# EAGLE design 7218 (EAGLE 5.11)
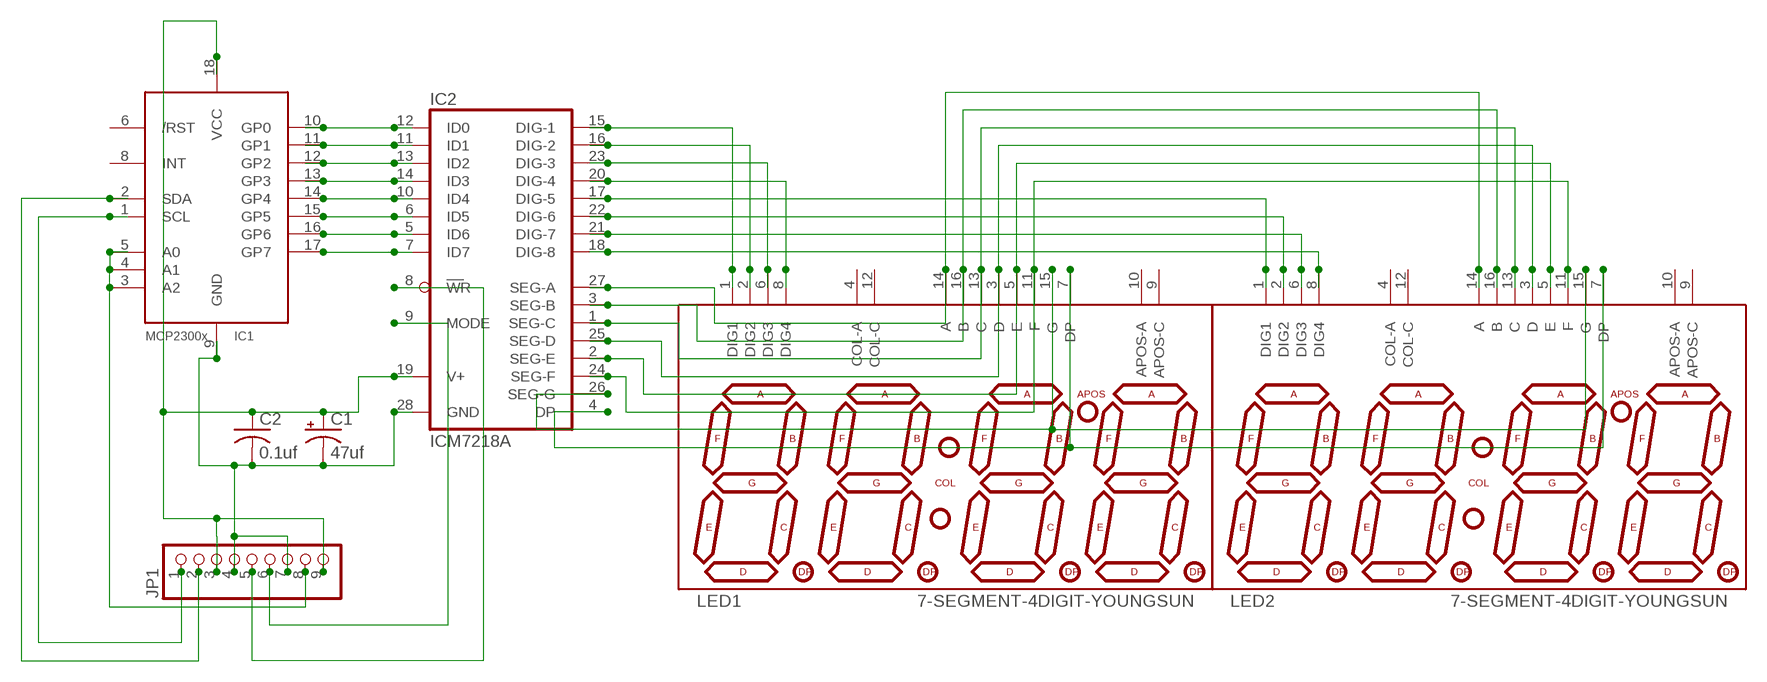
[diagram p0: schematic, sheet 1]

## Parts
C1  47uf  CAP_POLPTH2  [CPOL-RADIAL-10UF-25V]
C2  0.1uf  C-US050-030X075  [C050-030X075]
IC1  MCP2300X/P  [DIL18]
IC2  ICM7218A  [DIL28-6]
JP1  PINHD-1X9  [1X09-BIG]
LED1  7-SEGMENT-4DIGIT-YOUNGSUN  [7-SEGMENT-4DIGIT-YOUNGSUN]
LED2  7-SEGMENT-4DIGIT-YOUNGSUN  [7-SEGMENT-4DIGIT-YOUNGSUN]

## Nets
N$1: IC1.10(GP0) IC2.12(ID0)
N$2: IC1.11(GP1) IC2.11(ID1)
N$3: IC1.12(GP2) IC2.13(ID2)
N$4: IC1.13(GP3) IC2.14(ID3)
N$5: IC1.14(GP4) IC2.10(ID4)
N$6: IC1.15(GP5) IC2.6(ID5)
N$7: IC1.16(GP6) IC2.5(ID6)
N$8: IC1.17(GP7) IC2.7(ID7)
N$10: C1.2(-) C2.2 IC1.9(GND) IC2.28(GND) JP1.4 JP1.7
N$11: IC2.15(DIG-1) LED1.1(DIG1)
N$12: IC2.16(DIG-2) LED1.2(DIG2)
N$13: IC2.23(DIG-3) LED1.6(DIG3)
N$14: IC2.20(DIG-4) LED1.8(DIG4)
N$15: IC2.17(DIG-5) LED2.1(DIG1)
N$16: IC2.22(DIG-6) LED2.2(DIG2)
N$17: IC2.21(DIG-7) LED2.6(DIG3)
N$18: IC2.18(DIG-8) LED2.8(DIG4)
N$19: IC2.27(SEG-A) LED1.14(A) LED2.14(A)
N$20: IC2.3(SEG-B) LED1.16(B) LED2.16(B)
N$21: IC2.1(SEG-C) LED1.13(C) LED2.13(C)
N$22: IC2.25(SEG-D) LED1.3(D) LED2.3(D)
N$23: IC2.2(SEG-E) LED1.5(E) LED2.5(E)
N$24: IC2.24(SEG-F) LED1.11(F) LED2.11(F)
N$25: IC2.26(SEG-G) LED1.15(G) LED2.15(G)
N$26: IC2.4(DP) LED1.7(DP) LED2.7(DP)
N$30: IC1.2(SDA) JP1.2
N$31: IC1.1(SCL) JP1.1
N$32: C1.1(+) C2.1 IC1.18(VCC) IC2.19(V+) JP1.3 JP1.9
N$33: IC2.8(WR) JP1.5
N$34: IC2.9(MODE) JP1.6
N$35: IC1.3(A2) IC1.4(A1) IC1.5(A0) JP1.8
Unconnected: IC1.6(/RST) IC1.8(INT) LED1.4(COL-A) LED1.9(APOS-C) LED1.10(APOS-A) LED1.12(COL-C) LED2.4(COL-A) LED2.9(APOS-C) LED2.10(APOS-A) LED2.12(COL-C)

## Library data of the parts
C1 = SparkFun:CAP_POL: Capacitor Polarized These are standard SMD and PTH capacitors. Normally 10uF, 47uF, and 100uF in electrolytic and tantalum varieties. Always verify the external diameter of the through hole cap, it varies with capacity, voltage, and manufacturer. The EIA devices should be standard.
C2 = adafruit:C-US: CAPACITOR, American symbol
IC1 = adafruit:MCP2300X: MCP23008 Inexpensive i2c i/o expander - 8 general purpose i/o pins with optional pullups
IC2 = maxim:ICM7218A: LED DECODER DRIVER; MF: INTERSIL; MPN: ICM7218AIJI; OC_FARNELL: 405991; OC_NEWARK: 06F7544
JP1 = adafruit:PINHD-1X9: Pin header 1x10 0.1" spacing With round pins
LED1 LED2 = SparkFun:7-SEGMENT-4DIGIT-YOUNGSUN: This is a part for the 4-Digit 7-segment LEDs from Young Sun. Different from the Digikey LEDs, all 16 pins are used. The LONGPADS Variant is used for a test jig, but you may like it because there is more pad to solder to. If you are concerned about routing space, the standard works just fine though.

## Board
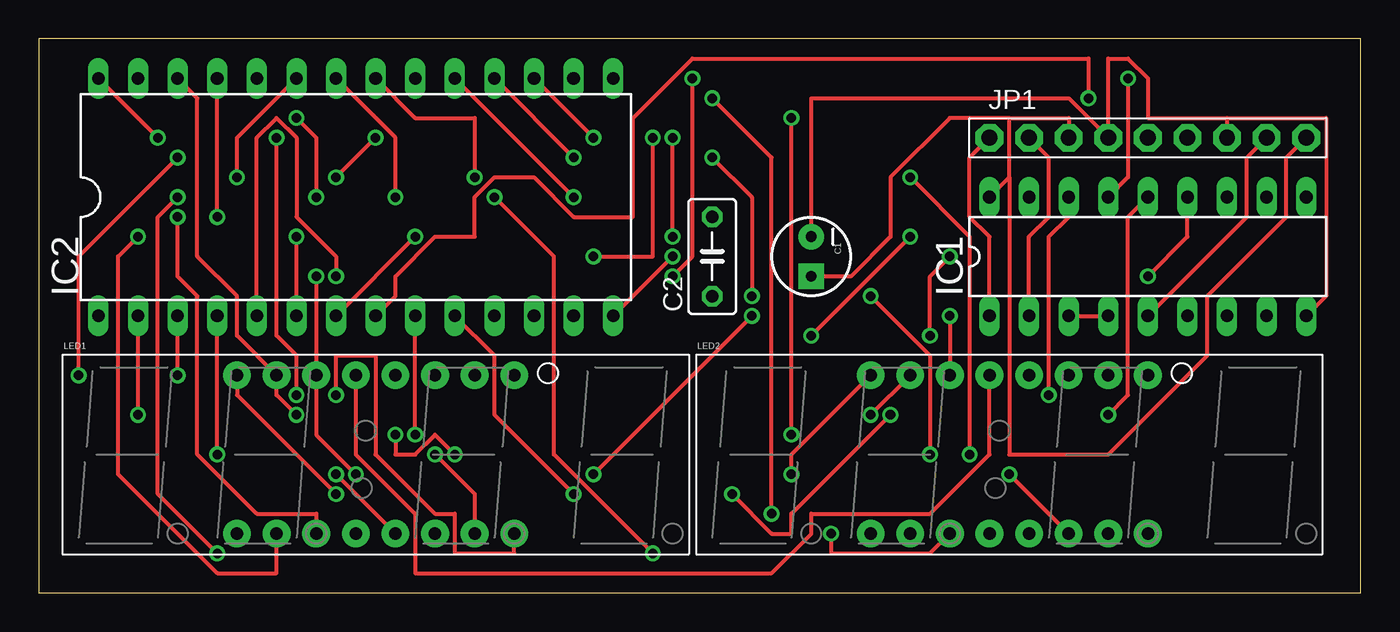
[diagram p1: board, top side]
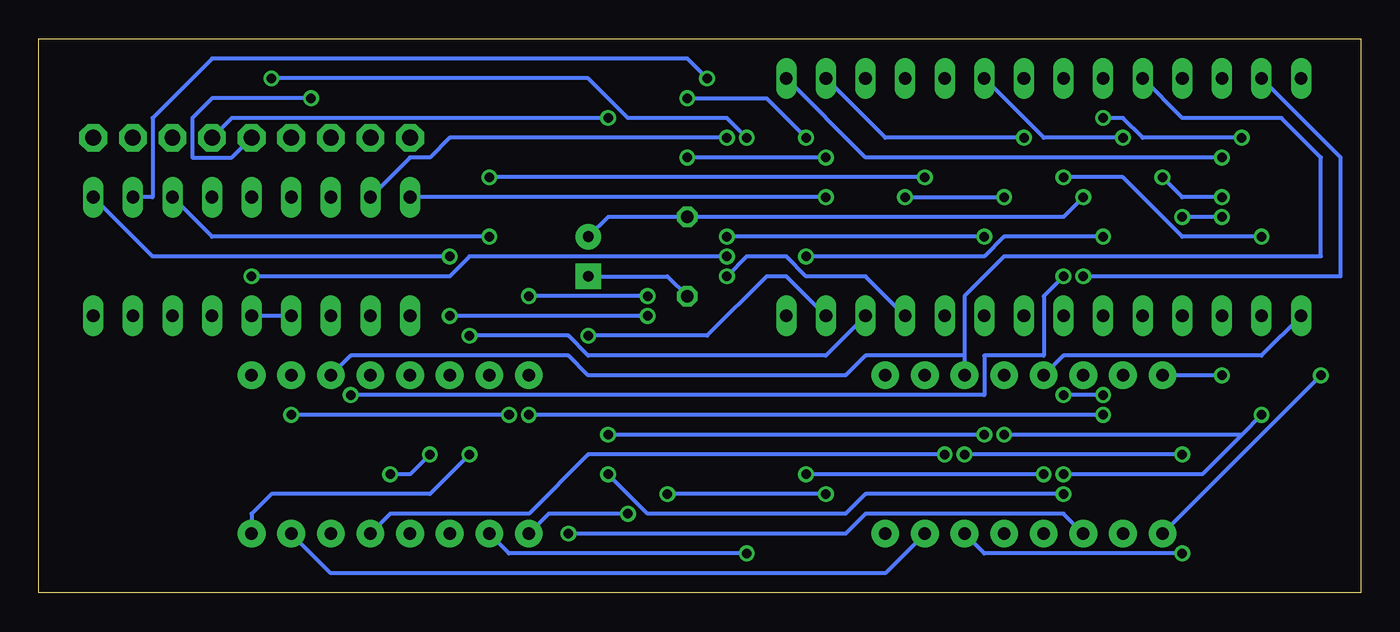
[diagram p2: board, bottom side, seen from below]

Size 84.76 x 35.55 mm. Coordinates in mm from the lower left corner, seen from the top.
Outline: 0,0 84.76,0 84.76,35.55 0,35.55 0,0
Copper layers (1*16): Top 0.035mm / dielectric 1.5mm / Bottom 0.035mm
Design rules "default": minimum track width 10mil, minimum drill 24mil, track to track 8mil, track to pad 8mil, pad to pad 8mil, via to via 8mil, smd to smd 8mil, copper to edge 40mil, drill to drill 8mil, minimum pad ring 10mil, minimum via ring 8mil, stop-mask expansion 4mil, vias tented up to drill 0mil, thermal gap 10mil

### Footprints (pad centres in the part's own frame; a part is rotated, then mirrored left to right if it is on the bottom)
CPOL-RADIAL-10UF-25V = drill 0.7 pad 1.651 square: 1 1.27,0 | drill 0.7 pad 1.651 round: 2 -1.27,0
C050-030X075 = drill 0.813 octagon: 1 -2.54,0; 2 2.54,0
DIL18 = drill 0.813 long: 1 -10.16,-3.81; 2 -7.62,-3.81; 3 -5.08,-3.81; 4 -2.54,-3.81; 5 0,-3.81; 6 2.54,-3.81; 7 5.08,-3.81; 8 7.62,-3.81; 9 10.16,-3.81; 10 10.16,3.81; 11 7.62,3.81; 12 5.08,3.81; 13 2.54,3.81; 14 0,3.81; 15 -2.54,3.81; 16 -5.08,3.81; 17 -7.62,3.81; 18 -10.16,3.81
DIL28-6 = drill 0.813 long: 1 -16.51,-7.62; 2 -13.97,-7.62; 3 -11.43,-7.62; 4 -8.89,-7.62; 5 -6.35,-7.62; 6 -3.81,-7.62; 7 -1.27,-7.62; 8 1.27,-7.62; 9 3.81,-7.62; 10 6.35,-7.62; 11 8.89,-7.62; 12 11.43,-7.62; 13 13.97,-7.62; 14 16.51,-7.62; 15 16.51,7.62; 16 13.97,7.62; 17 11.43,7.62; 18 8.89,7.62; 19 6.35,7.62; 20 3.81,7.62; 21 1.27,7.62; 22 -1.27,7.62; 23 -3.81,7.62; 24 -6.35,7.62; 25 -8.89,7.62; 26 -11.43,7.62; 27 -13.97,7.62; 28 -16.51,7.62
1X09-BIG = drill 1.016 pad 1.778 octagon: 1 -10.16,0; 2 -7.62,0; 3 -5.08,0; 4 -2.54,0; 5 0,0; 6 2.54,0; 7 5.08,0; 8 7.62,0; 9 10.16,0
7-SEGMENT-4DIGIT-YOUNGSUN = drill 0.8 pad 1.778 round: 1 -8.89,-5.08; 2 -6.35,-5.08; 3 -3.81,-5.08; 4 -1.27,-5.08; 5 1.27,-5.08; 6 3.81,-5.08; 7 6.35,-5.08; 8 8.89,-5.08; 9 8.89,5.08; 10 6.35,5.08; 11 3.81,5.08; 12 1.27,5.08; 13 -1.27,5.08; 14 -3.81,5.08; 15 -6.35,5.08; 16 -8.89,5.08

### Placement (x,y rotation side)
C1  49.53,21.59 270 top
C2  43.18,21.59 90 top
IC1  71.12,21.59 0 top
IC2  20.32,25.4 0 top
JP1  71.12,29.21 0 top
LED1  21.59,8.89 0 top
LED2  62.23,8.89 0 top

### Tracks (layer width: path | path; a pad name or v marks a point on that pad's centre or on a via)
N$1  (via drill 0.61)
  Top 0.254: v57.15,16.51 57.15,20.32 v58.42,21.59
  Bottom 0.254: IC2.12 34.29,15.24 49.53,15.24 50.8,16.51 v57.15,16.51 | v58.42,21.59 77.47,21.59 IC1.10
N$2  (via drill 0.61)
  Top 0.254: v40.64,20.32 41.91,21.59 v41.91,33.02
  Bottom 0.254: IC2.11 31.75,20.32 35.56,20.32 36.83,21.59 39.37,21.59 v40.64,20.32 | v41.91,33.02 43.18,34.29 73.66,34.29 77.47,30.48 77.47,25.4 IC1.11
N$3  (via drill 0.61)
  Top 0.254: v49.53,16.51 v55.88,22.86
  Bottom 0.254: IC2.13 36.83,20.32 38.1,20.32 41.91,16.51 v49.53,16.51 | v55.88,22.86 73.66,22.86 IC1.12
N$4  (via drill 0.61)
  Top 0.254: IC2.14 v40.64,21.59 | v71.12,20.32 73.66,22.86 IC1.13
  Bottom 0.254: v40.64,21.59 57.15,21.59 58.42,20.32 v71.12,20.32
N$5  (via drill 0.61)
  Top 0.254: IC2.10 29.21,15.24 29.21,11.43 v34.29,6.35 | v44.45,6.35 46.99,3.81 48.26,3.81 48.26,5.08 v54.61,11.43 | v68.58,11.43 69.85,12.7 69.85,24.13 IC1.14
  Bottom 0.254: v34.29,6.35 v44.45,6.35 | v54.61,11.43 v68.58,11.43
N$6  (via drill 0.61)
  Top 0.254: IC2.6 v16.51,22.86 | v35.56,21.59 39.37,21.59 v39.37,29.21 | v69.85,33.02 69.85,26.67 IC1.15
  Bottom 0.254: v16.51,22.86 22.86,22.86 24.13,21.59 v35.56,21.59 | v39.37,29.21 40.64,30.48 46.99,30.48 49.53,33.02 v69.85,33.02
N$7  (via drill 0.61)
  Top 0.254: IC2.5 13.97,29.21 15.24,30.48 16.51,29.21 16.51,24.13 19.05,21.59 v19.05,20.32 | v64.77,12.7 64.77,22.86 66.04,24.13 IC1.16
  Bottom 0.254: v19.05,20.32 20.32,19.05 20.32,15.24 24.13,15.24 24.13,12.7 v64.77,12.7
N$8  (via drill 0.61)
  Top 0.254: IC2.7 v24.13,22.86 | v40.64,22.86 v40.64,29.21
  Bottom 0.254: v24.13,22.86 v40.64,22.86 | v40.64,29.21 58.42,29.21 59.69,27.94 60.96,27.94 IC1.17
N$10  (via drill 0.61)
  Top 0.254: IC1.9 82.55,19.05 82.55,30.48 76.2,30.48 | 76.2,30.48 JP1.7 | IC2.28 v7.62,29.21 | v16.51,30.48 17.78,29.21 v17.78,25.4 | C1.2 49.53,31.75 66.04,31.75 JP1.4 68.58,34.29 69.85,34.29 71.12,33.02 71.12,30.48 76.2,30.48
  Bottom 0.254: v7.62,29.21 13.97,29.21 15.24,30.48 v16.51,30.48 | v17.78,25.4 19.05,24.13 C2.2 48.26,24.13 C1.2
N$11  (via drill 0.61)
  Top 0.254: v8.89,27.94 2.54,21.59 v2.54,13.97
  Bottom 0.254: IC2.15 31.75,27.94 v8.89,27.94 | LED1.1 v2.54,13.97
N$12  (via drill 0.61)
  Top 0.254: v19.05,26.67 v21.59,29.21 | v6.35,22.86 5.08,21.59 5.08,7.62 11.43,1.27 15.24,1.27 LED1.2
  Bottom 0.254: IC2.16 30.48,29.21 v21.59,29.21 | v19.05,26.67 15.24,26.67 11.43,22.86 v6.35,22.86
N$13  (via drill 0.61)
  Top 0.254: IC2.23 12.7,29.21 v12.7,26.67 | v8.89,25.4 7.62,24.13 7.62,6.35 v11.43,2.54
  Bottom 0.254: v12.7,26.67 11.43,25.4 v8.89,25.4 | v11.43,2.54 24.13,2.54 LED1.6
N$14  (via drill 0.61)
  Top 0.254: v15.24,29.21 15.24,16.51 16.51,15.24 v16.51,12.7 | v19.05,12.7 19.05,15.24 21.59,15.24 21.59,8.89 25.4,5.08 26.67,5.08 26.67,2.54 30.48,2.54 LED1.8
  Bottom 0.254: IC2.20 20.32,29.21 v15.24,29.21 | v16.51,12.7 v19.05,12.7
N$15  (via drill 0.61)
  Top 0.254: v35.56,29.21 IC2.17 | v43.18,31.75 46.99,27.94 v46.99,5.08
  Bottom 0.254: v35.56,29.21 38.1,31.75 v43.18,31.75 | v46.99,5.08 52.07,5.08 LED2.1
N$16  (via drill 0.61)
  Top 0.254: IC2.22 22.86,29.21 v22.86,25.4 | v29.21,25.4 33.02,21.59 33.02,8.89 v39.37,2.54
  Bottom 0.254: v29.21,25.4 v22.86,25.4 | v39.37,2.54 54.61,2.54 LED2.2
N$17  (via drill 0.61)
  Top 0.254: IC2.21 24.13,30.48 27.94,30.48 v27.94,26.67 | v55.88,26.67 59.69,22.86 v59.69,8.89 | v62.23,7.62 LED2.6
  Bottom 0.254: v27.94,26.67 v55.88,26.67 | v59.69,8.89 60.96,7.62 v62.23,7.62
N$18  (via drill 0.61)
  Top 0.254: IC2.18 v34.29,27.94 | v43.18,27.94 45.72,25.4 v45.72,19.05 | v53.34,19.05 57.15,15.24 v57.15,8.89
  Bottom 0.254: v34.29,27.94 v43.18,27.94 | v45.72,19.05 v53.34,19.05 | v57.15,8.89 59.69,6.35 69.85,6.35 71.12,5.08 LED2.8
N$19  (via drill 0.61)
  Top 0.254: v17.78,20.32 LED1.14 17.78,10.16 v20.32,7.62 | v58.42,17.78 LED2.14 | v35.56,7.62 v45.72,17.78
  Bottom 0.254: IC2.27 1.27,27.94 1.27,20.32 v17.78,20.32 | v45.72,17.78 v58.42,17.78 | v20.32,7.62 v35.56,7.62
N$20  (via drill 0.61)
  Top 0.254: v8.89,13.97 IC2.3 | LED2.16 48.26,8.89 v48.26,7.62 | v19.05,6.35 12.7,12.7 LED1.16
  Bottom 0.254: v8.89,13.97 LED1.16 | v48.26,7.62 45.72,5.08 33.02,5.08 31.75,6.35 v19.05,6.35
N$21
  Top 0.254: LED2.13 60.96,8.89 57.15,5.08 49.53,5.08 49.53,3.81 46.99,1.27 24.13,1.27 24.13,5.08 20.32,8.89 LED1.13
  Bottom 0.254: IC2.1 6.35,15.24 19.05,15.24 LED1.13
N$22  (via drill 0.61)
  Top 0.254: v11.43,24.13 IC2.25 | v8.89,24.13 8.89,20.32 10.16,19.05 10.16,8.89 13.97,5.08 17.78,5.08 LED1.3 | LED2.3 57.15,2.54 50.8,2.54 v50.8,3.81
  Bottom 0.254: v8.89,24.13 v11.43,24.13 | v50.8,3.81 33.02,3.81 31.75,5.08 19.05,5.08 LED1.3
N$23  (via drill 0.61)
  Top 0.254: v6.35,11.43 IC2.2 | v19.05,7.62 LED1.5 | v26.67,8.89 25.4,10.16 24.13,8.89 22.86,8.89 v22.86,10.16
  Bottom 0.254: 7.62,10.16 10.16,7.62 v19.05,7.62 | v6.35,11.43 7.62,10.16 | LED2.5 62.23,5.08 53.34,5.08 49.53,8.89 v26.67,8.89 | 7.62,10.16 v22.86,10.16
N$24
  Bottom 0.254: IC2.24 11.43,30.48 5.08,30.48 2.54,27.94 2.54,21.59 22.86,21.59 25.4,19.05 25.4,15.24 | 25.4,15.24 LED1.11 | LED2.11 64.77,15.24 50.8,15.24 49.53,13.97 33.02,13.97 31.75,15.24 25.4,15.24
N$25  (via drill 0.61)
  Top 0.254: IC2.26 10.16,31.75 10.16,21.59 12.7,19.05 12.7,16.51 LED1.15 15.24,12.7 v16.51,11.43 | v53.34,11.43 LED2.15
  Bottom 0.254: v16.51,11.43 v53.34,11.43
N$26  (via drill 0.61)
  Top 0.254: v11.43,8.89 IC2.4 | v25.4,8.89 27.94,6.35 LED1.7
  Bottom 0.254: v11.43,8.89 v25.4,8.89 | LED2.7 66.04,1.27 30.48,1.27 LED1.7
N$30
  Top 0.254: IC1.2 63.5,22.86 64.77,24.13 64.77,27.94 JP1.2
N$31
  Top 0.254: IC1.1 60.96,22.86 59.69,24.13 59.69,27.94 JP1.1
N$32  (via drill 0.61)
  Top 0.254: IC1.18 62.23,26.67 | 62.23,26.67 62.23,30.48 | 62.23,30.48 66.04,30.48 JP1.3 | IC2.19 v34.29,25.4 | JP1.9 80.01,27.94 80.01,24.13 74.93,19.05 74.93,15.24 68.58,8.89 62.23,8.89 62.23,26.67 | C1.1 52.07,20.32 54.61,22.86 54.61,26.67 58.42,30.48 62.23,30.48
  Bottom 0.254: C2.1 44.45,20.32 C1.1 | v34.29,25.4 IC1.18
N$33  (via drill 0.61)
  Top 0.254: IC2.8 22.86,19.05 22.86,20.32 25.4,22.86 27.94,22.86 27.94,25.4 29.21,26.67 31.75,26.67 34.29,24.13 38.1,24.13 38.1,30.48 41.91,34.29 67.31,34.29 v67.31,31.75
  Bottom 0.254: v67.31,31.75 73.66,31.75 74.93,30.48 74.93,27.94 72.39,27.94 JP1.5
N$34  (via drill 0.61)
  Top 0.254: v24.13,10.16 IC2.9 | v48.26,10.16 v48.26,30.48
  Bottom 0.254: v24.13,10.16 v48.26,10.16 | v48.26,30.48 72.39,30.48 JP1.6
N$35
  Top 0.254: IC1.3 IC1.4 | JP1.8 77.47,27.94 77.47,24.13 IC1.5
  Bottom 0.254: IC1.4 IC1.5